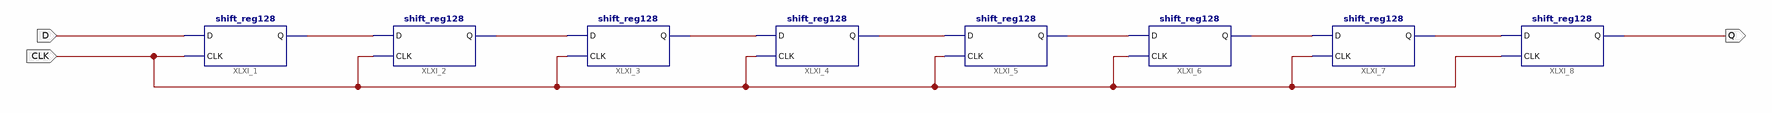
[diagram p0: schematic sheet 1]
// Xilinx ISE schematic shift_reg128_top.sch (spartan3a) as structural Verilog: 8 symbols, 3 ports
module shift_reg128_top (
  input  D,
  input  CLK,
  output Q
);

  wire XLXN_1, XLXN_2, XLXN_3, XLXN_4, XLXN_5, XLXN_6, XLXN_7;

  shift_reg128 XLXI_1 (.D(D), .CLK(CLK), .Q(XLXN_1));
  shift_reg128 XLXI_2 (.D(XLXN_1), .CLK(CLK), .Q(XLXN_2));
  shift_reg128 XLXI_3 (.D(XLXN_2), .CLK(CLK), .Q(XLXN_3));
  shift_reg128 XLXI_4 (.D(XLXN_3), .CLK(CLK), .Q(XLXN_4));
  shift_reg128 XLXI_5 (.D(XLXN_4), .CLK(CLK), .Q(XLXN_5));
  shift_reg128 XLXI_6 (.D(XLXN_5), .CLK(CLK), .Q(XLXN_6));
  shift_reg128 XLXI_7 (.D(XLXN_6), .CLK(CLK), .Q(XLXN_7));
  shift_reg128 XLXI_8 (.D(XLXN_7), .CLK(CLK), .Q(Q));
endmodule
